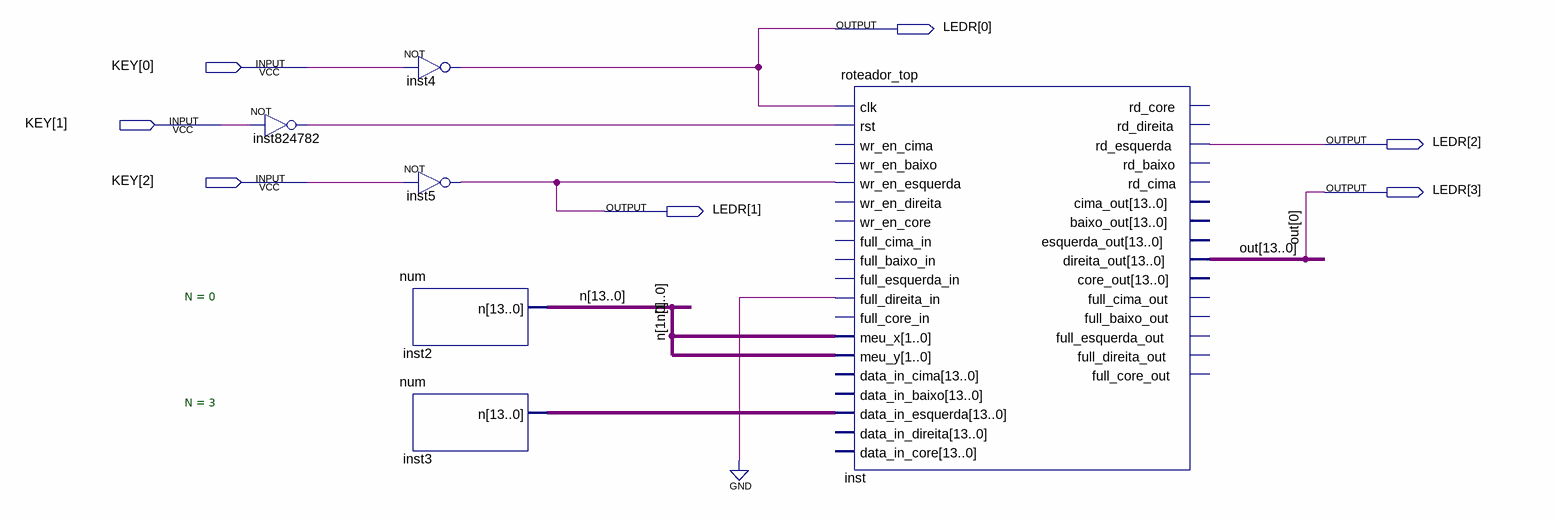
[diagram p0: schematic sheet]
// Quartus schematic teste_roteador.bdf as structural Verilog: 6 symbols, 7 pins
module teste_roteador (
  input  [2:0] KEY,
  output [3:0] LEDR
);

  wire inst824782_out;
  wire [13:0] inst3_n, n;
  wire [13:1] out;

  not inst824782 (inst824782_out, KEY[1]);
  not inst4 (LEDR[0], KEY[0]);
  not inst5 (LEDR[1], KEY[2]);
  num #(.N(0)) inst2 (.n(n));
  num #(.N(3)) inst3 (.n(inst3_n));
  roteador_top inst (
    .clk(LEDR[0]), .rst(inst824782_out), .wr_en_esquerda(LEDR[1]), .full_direita_in(1'b0), .meu_x(n[1:0]),
    .meu_y(n[1:0]), .data_in_esquerda(inst3_n), .rd_esquerda(LEDR[2]), .direita_out({out, LEDR[3]}));  // open: wr_en_cima, wr_en_baixo, wr_en_direita, wr_en_core, full_cima_in, full_baixo_in, full_esquerda_in, full_core_in, data_in_cima, data_in_baixo, data_in_direita, data_in_core, rd_core, rd_direita, rd_baixo, rd_cima, cima_out, baixo_out, esquerda_out, core_out, full_cima_out, full_baixo_out, full_esquerda_out, full_direita_out, full_core_out

  // Other names for the same wires on the sheet: out[0] = LEDR[3]
endmodule
